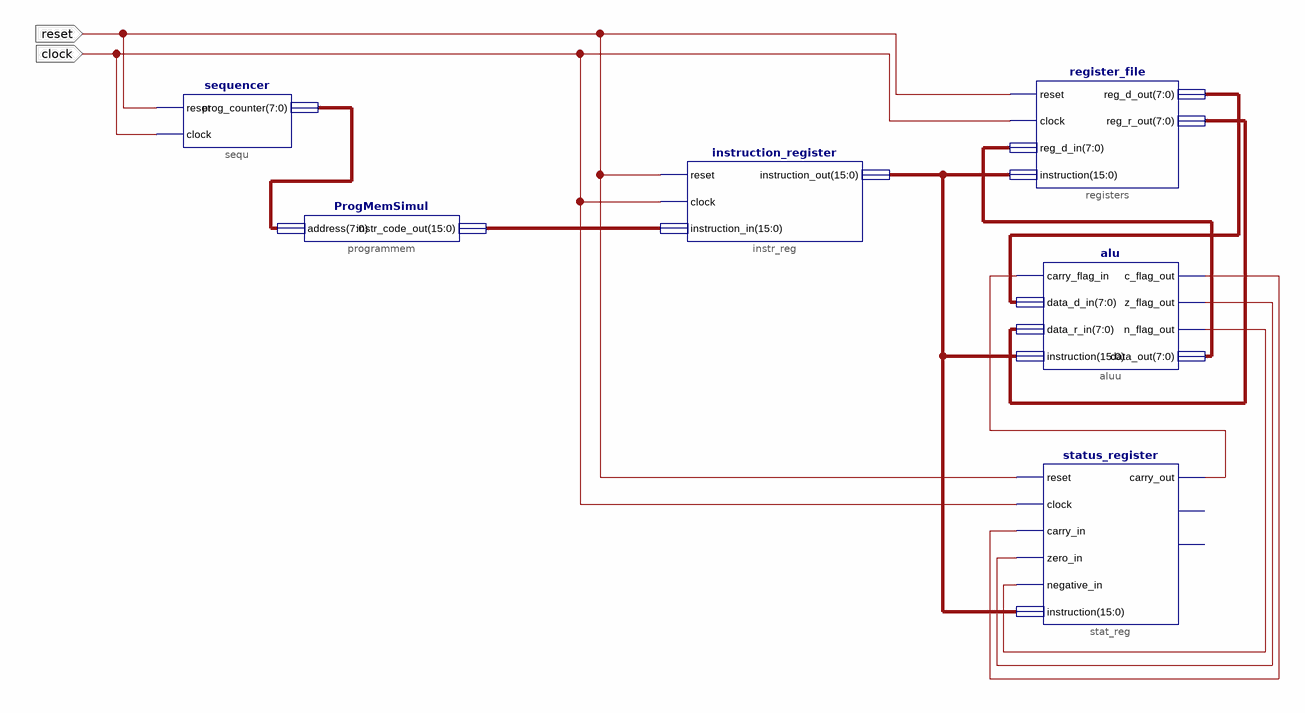
[diagram p0: schematic sheet 1]
// Xilinx ISE schematic cpu.sch (zynq) as structural Verilog: 6 symbols, 2 ports
module cpu (
  input  clock,
  input  reset
);

  wire carry_flag_in, n_flag_out, XLXN_80, z_flag_out;
  wire [7:0] XLXN_5, XLXN_8, XLXN_35, XLXN_164;
  wire [15:0] instr, instruction;

  instruction_register instr_reg (.reset(reset), .clock(clock), .instruction_in(instruction), .instruction_out(instr));
  status_register stat_reg (
    .reset(reset), .clock(clock), .carry_in(XLXN_80), .zero_in(z_flag_out), .negative_in(n_flag_out),
    .instruction(instr), .carry_out(carry_flag_in));  // open: zero_out, negative_out
  register_file registers (
    .reset(reset), .clock(clock), .reg_d_in(XLXN_5), .instruction(instr), .reg_d_out(XLXN_35),
    .reg_r_out(XLXN_8));
  ProgMemSimul programmem (.address(XLXN_164), .instr_code_out(instruction));
  alu aluu (
    .carry_flag_in(carry_flag_in), .data_d_in(XLXN_35), .data_r_in(XLXN_8), .instruction(instr),
    .c_flag_out(XLXN_80), .z_flag_out(z_flag_out), .n_flag_out(n_flag_out), .data_out(XLXN_5));
  sequencer sequ (.reset(reset), .clock(clock), .prog_counter(XLXN_164));
endmodule
